# Altium schematic sheet Sheet_5V_3A.SchDoc
size A4; SheetNumber: 1; SheetTotal: 1
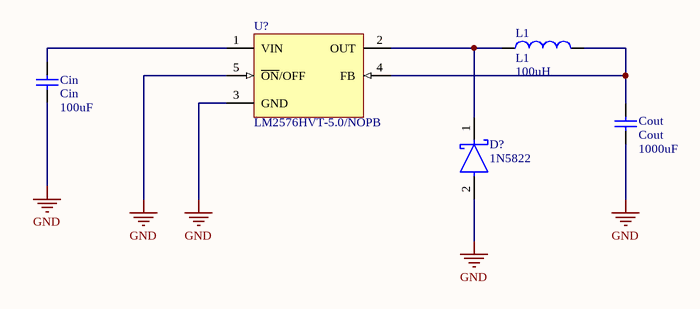
[diagram p0: Sheet_5V_3A.SchDoc]

## Parts
Cin  Cin  value 100uF  [RAD-0.3]
Cout  Cout  value 1000uF  [RAD-0.3]
D?  1N5822  [FP-DO-201AD-MFG]
L1  L1  value 100uH  [0402-A]
U?  LM2576HVT-5.0/NOPB  [KC0005A]

## Nets
GND: Cin.2 Cout.2 D?.2(A) U?.3(GND) U?.5(~{ON}/OFF)
NetCin_1: Cin.1 U?.1(VIN)
NetCout_1: Cout.1 L1.2 U?.4(FB)
NetD?_1: D?.1(C) L1.1 U?.2(OUT)

## Library data of the parts
Cin Cout = Cap: Capacitor; Published: 8-Jun-2000; LatestRevisionDate: 17-Jul-2002; LatestRevisionNote: Re-released for DXP Platform.; PackageReference: RAD-0.3; Publisher: Altium Limited; PackageDescription: Radial Cap, Thru-Hole; 2 Leads; 0.3 in Pin Spacing
D? = CMP-12187-000025-1: DIODE SCHOTTKY 40V 3A DO201AD; Manufacturer: STMicroelectronics; Max Junction Temp: +150°C; Peak Reverse Current: 2mA; Max Surge Forward Current: 80A; Temperature Range High: +150°C; Automotive: No; RoHS: TRUE; ComponentLink2Description: Datasheet; Manufacturer Part Number: 1N5822; Lead Free: Yes; Octopart: https://octopart.com/1n5822-stmicroelectronics-323225; Device Class L2: Diodes; Max Repetitive Reverse Voltage: 40V; Temperature: to +150°C; Height: 5.3mm; Category: Diode; Digikey Description: DIODE SCHOTTKY 40V 3A DO201AD; ComponentLink2URL: https://www.st.com/resource/en/datasheet/1n5822.pdf; Device Class L3: Schottky Diodes; Device Class L1: Discrete Semiconductors; Forward Current: 3A; Mouser Description: Schottky Diodes & Rectifiers Vr/40V Io/3A BULK; Package: DO-201AD
L1 = Inductor: Code_IEC: 1005; Published: 8-Jun-2000; LatestRevisionDate: 29-May-2009; LatestRevisionNote: IPC-7351 Footprint Added.; PackageReference: 0402-A; Publisher: Altium Limited; PackageDescription: Chip Inductor; Code_JEITA: 0402
U? = CMP-0069-01992-3: SIMPLE SWITCHER® 3A Step-Down Voltage Regulator, 5-pin TO-220, Pb-Free; Manufacturer: Texas Instruments; PowerWise: N; PackageTopMarking: NSUZXYTTE#*LM2576HVT*-5.0 P+; Code_JEDEC: TO-220-AB; PackageReference: KC0005A; CompType: Switcher; PinCount: 5; RoHS: Y; PackageDescription: TO-220, Molded, 5 Lead, Straight; ComponentLink1URL: http://www.ti.com/general/docs/lit/getliterature.tsp?genericPartNumber=LM2576HV&fileType=pdf; ComponentLink1Description: Datasheet URL